# EAGLE design DNVT3 (EAGLE 9.6.2)
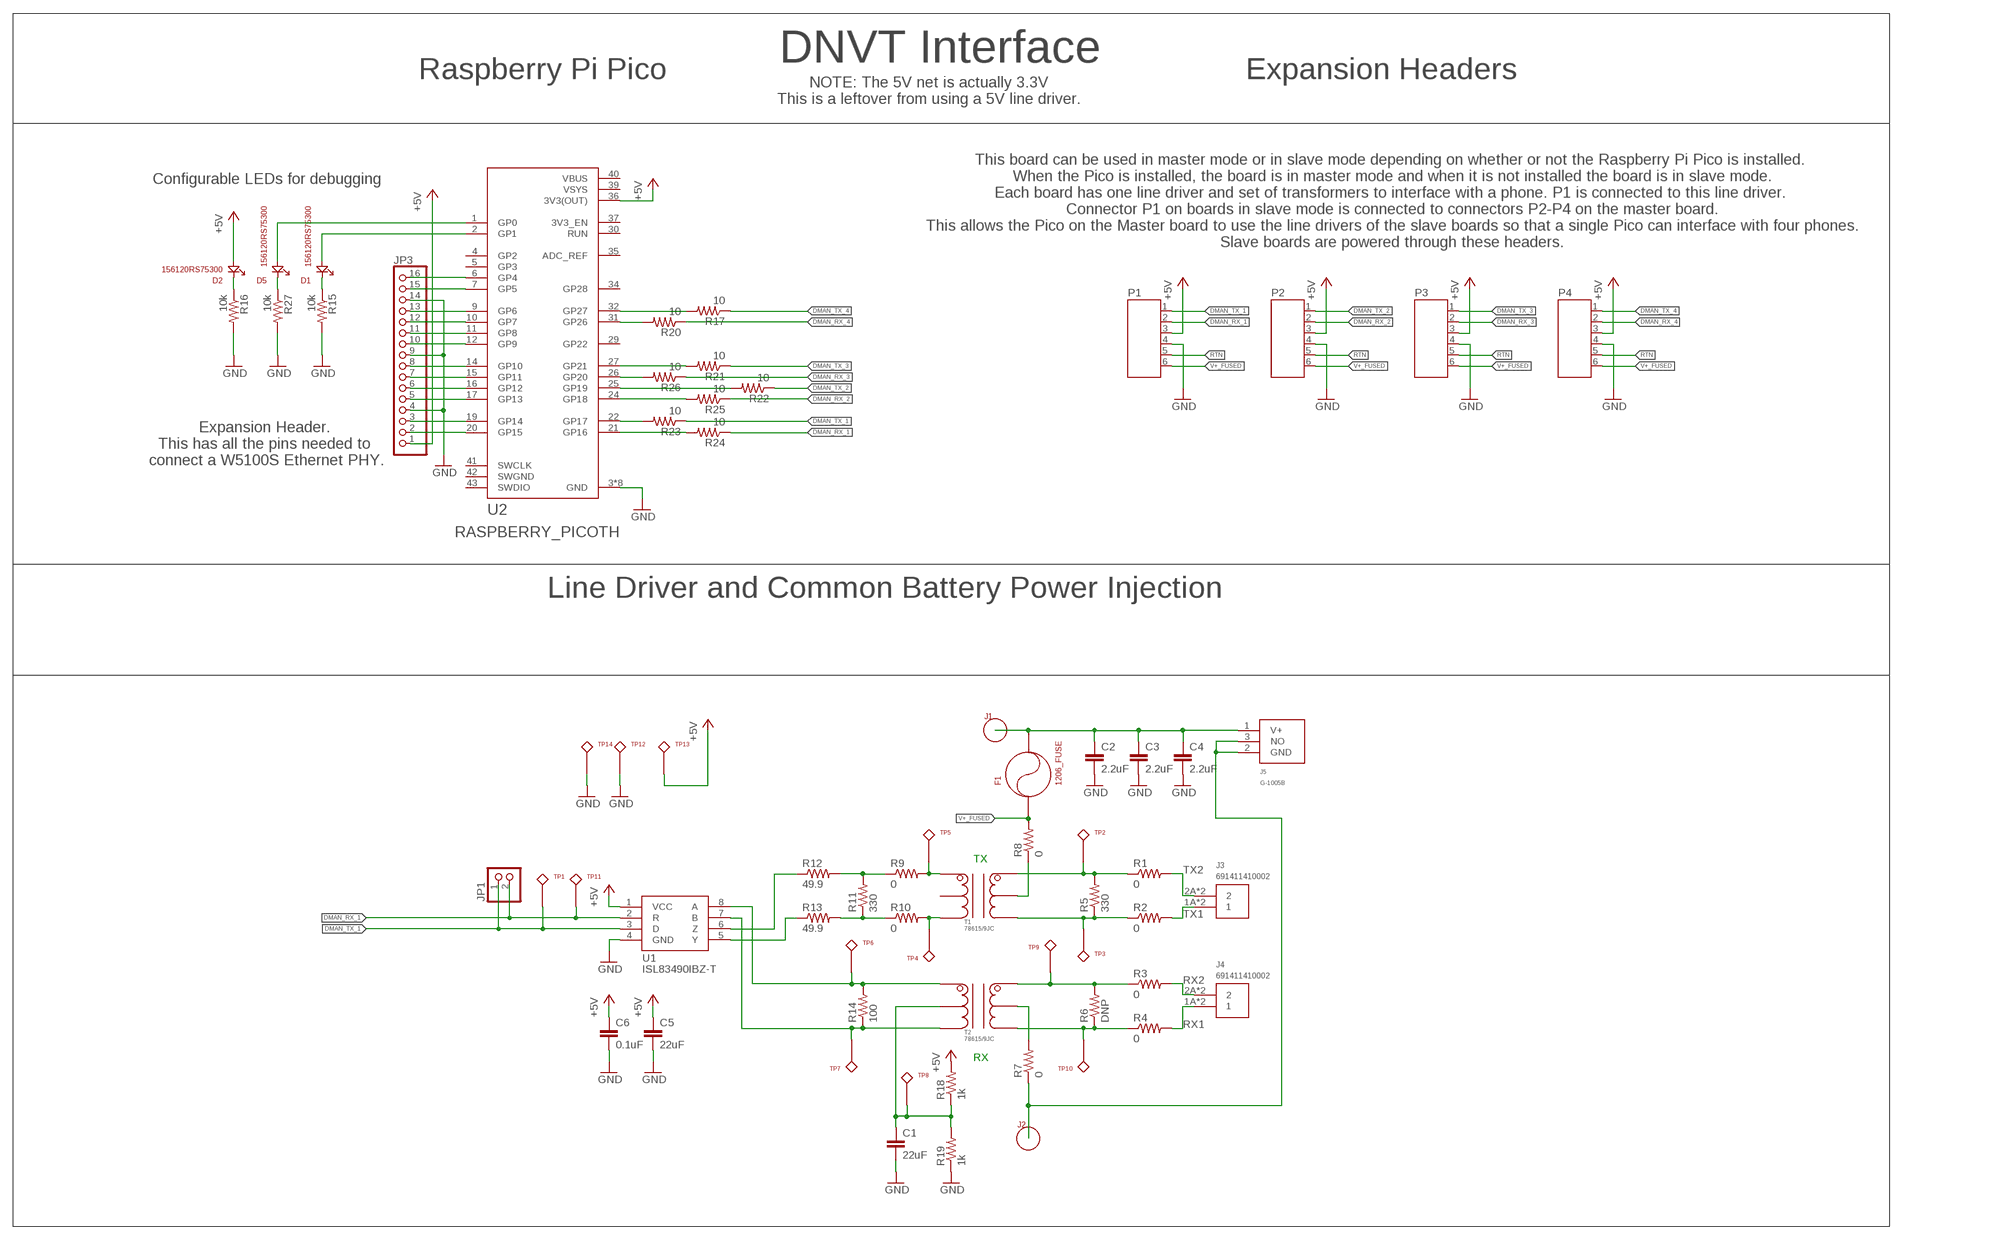
[diagram p0: schematic, sheet 1]

## Parts
C1  22uF  1210_CAPACITOR  [1210]
C2  2.2uF  1210_CAPACITOR  [1210]
C3  2.2uF  1210_CAPACITOR  [1210]
C4  2.2uF  1210_CAPACITOR  [1210]
C5  22uF  1210_CAPACITOR  [1210]
C6  0.1uF  0603_CAPACITOR  [0603]
D1  156120RS75300  [1206_REV]
D2  156120RS75300  [1206_REV]
D5  156120RS75300  [1206_REV]
F1  1206_FUSE  [1206]
J1  BANANA  [BANANA]
J2  BANANA  [BANANA]
J3  691411410002  [691411410002]
J4  691411410002  [691411410002]
J5  G-1005B  [G-1005B]
JP1  PINHD-1X2  [1X02]
JP3  PINHD-1X16  [1X16]
P1  JST-PH6  [JST-PH6]
P2  JST-PH6  [JST-PH6]
P3  JST-PH6  [JST-PH6]
P4  JST-PH6  [JST-PH6]
R1  0  R-US_R0805  [R0805]
R2  0  R-US_R0805  [R0805]
R3  0  R-US_R0805  [R0805]
R4  0  R-US_R0805  [R0805]
R5  330  R-US_R0805  [R0805]
R6  DNP  R-US_R0805  [R0805]
R7  0  R-US_R0805  [R0805]
R8  0  R-US_R0805  [R0805]
R9  0  R-US_R0805  [R0805]
R10  0  R-US_R0805  [R0805]
R11  330  R-US_R0805  [R0805]
R12  49.9  R-US_R0805  [R0805]
R13  49.9  R-US_R0805  [R0805]
R14  100  1206_RESISTOR  [1206]
R15  10k  0603_RESISTOR  [0603]
R16  10k  0603_RESISTOR  [0603]
R17  10  0603_RESISTOR  [0603]
R18  1k  0603_RESISTOR  [0603]
R19  1k  0603_RESISTOR  [0603]
R20  10  0603_RESISTOR  [0603]
R21  10  0603_RESISTOR  [0603]
R22  10  0603_RESISTOR  [0603]
R23  10  0603_RESISTOR  [0603]
R24  10  0603_RESISTOR  [0603]
R25  10  0603_RESISTOR  [0603]
R26  10  0603_RESISTOR  [0603]
R27  10k  0603_RESISTOR  [0603]
T1  78615/9JC  [786]
T2  78615/9JC  [786]
TP1  5001  [5001]
TP2  5002  [5001]
TP3  5002  [5001]
TP4  5002  [5001]
TP5  5002  [5001]
TP6  5002  [5001]
TP7  5002  [5001]
TP8  5002  [5001]
TP9  5002  [5001]
TP10  5002  [5001]
TP11  5001  [5001]
TP12  5001  [5001]
TP13  5001  [5001]
TP14  5001  [5001]
U1  ISL83490IBZ-T  [SOIC8]
U2  RASPBERRY_PICOTH  [PICO-PKG-TH]

## Nets
+5V: C5.1 C6.1 D2.A JP3.1 P1.3 P2.3 P3.3 P4.3 R18.2 TP13.P$1 U1.1(VCC) U2.36(3V3(OUT))
DMAN_RX_1: JP1.2 P1.2 R24.1 TP11.P$1 U1.2(R)
DMAN_RX_2: P2.2 R25.1
DMAN_RX_3: P3.2 R26.1
DMAN_RX_4: P4.2 R20.1
DMAN_TX_1: JP1.1 P1.1 R23.1 TP1.P$1 U1.3(D)
DMAN_TX_2: P2.1 R22.1
DMAN_TX_3: P3.1 R21.1
DMAN_TX_4: P4.1 R17.1
GND: C1.2 C2.2 C3.2 C4.2 C5.2 C6.2 JP3.4 JP3.9 JP3.14 P1.4 P2.4 P3.4 P4.4 R15.2 R16.2 R19.1 R27.2 TP12.P$1 TP14.P$1 U1.4(GND) U2.3(GND) U2.8(GND) U2.13(GND) U2.18(GND) U2.23(GND) U2.28(GND) U2.33(GND) U2.38(GND)
N$1: R1.1 R5.2 T1.6 TP2.P$1
N$2: R2.1 R5.1 T1.4 TP3.P$1
N$3: R3.1 R6.2 T2.6 TP9.P$1
N$4: R4.1 R6.1 T2.4 TP10.P$1
N$5: R7.2 T2.5
N$6: R8.1 T1.5
N$7: C1.1 R18.1 R19.2 T2.2 TP8.P$1
N$8: R14.1 T2.3 TP7.P$1 U1.7(B)
N$9: R14.2 T2.1 TP6.P$1 U1.8(A)
N$10: R9.2 T1.1 TP5.P$1
N$11: R10.2 T1.3 TP4.P$1
N$12: R9.1 R11.2 R12.2
N$13: R10.1 R11.1 R13.2
N$14: R12.1 U1.6(Z)
N$15: R13.1 U1.5(Y)
N$16: R24.2 U2.21(GP16)
N$17: R23.2 U2.22(GP17)
N$18: D1.K R15.1
N$19: C2.1 C3.1 C4.1 F1.2 J1.P$1 J5.1(V+)
N$20: D2.K R16.1
N$21: R25.2 U2.24(GP18)
N$22: R22.2 U2.25(GP19)
N$23: R21.2 U2.27(GP21)
N$24: R26.2 U2.26(GP20)
N$25: R17.2 U2.32(GP27)
N$26: R20.2 U2.31(GP26)
N$27: D5.K R27.1
N$28: JP3.16 U2.6(GP4)
N$29: D1.A U2.2(GP1)
N$30: D5.A U2.1(GP0)
N$31: JP3.15 U2.7(GP5)
N$32: JP3.13 U2.9(GP6)
N$33: JP3.12 U2.10(GP7)
N$34: JP3.11 U2.11(GP8)
N$35: JP3.10 U2.12(GP9)
N$36: JP3.8 U2.14(GP10)
N$37: JP3.7 U2.15(GP11)
N$38: JP3.6 U2.16(GP12)
N$39: JP3.5 U2.17(GP13)
N$40: JP3.3 U2.19(GP14)
N$41: JP3.2 U2.20(GP15)
RTN: J2.P$1 J5.2(GND) J5.3(NO) P1.5 P2.5 P3.5 P4.5 R7.1
RX1: J4.1A J4.1B R4.2
RX2: J4.2A J4.2B R3.2
TX1: J3.1A J3.1B R2.2
TX2: J3.2A J3.2B R1.2
V+_FUSED: F1.1 P1.6 P2.6 P3.6 P4.6 R8.2
Unconnected: T1.2 U2.4(GP2) U2.5(GP3) U2.29(GP22) U2.30(RUN) U2.34(GP28) U2.35(ADC_REF) U2.37(3V3_EN) U2.41(SWCLK) U2.43(SWDIO)

## Notes on the sheet
- DNVT Interface
- Raspberry Pi Pico | Expansion Headers
- NOTE: The 5V net is actually 3.3V
  This is a leftover from using a 5V line driver.
- Configurable LEDs for debugging
- This board can be used in master mode or in slave mode depending on whether or not the Raspberry Pi Pico is installed. 
  When the Pico is installed, the board is in master mode and when it is not installed the board is in slave mode.
  Each board has one line driver and set of transformers to interface with a phone. P1 is connected to this line driver. 
  Connector P1 on boards in slave mode is connected to connectors P2-P4 on the master board.
  This allows the Pico on the Master board to use the line drivers of the slave boards so that a single Pico can interface with four phones.
  Slave boards are powered through these headers.
- Expansion Header. 
  This has all the pins needed to 
  connect a W5100S Ethernet PHY.
- Line Driver and Common Battery Power Injection
- TX
- RX

## Power pins joined to a net without a drawn wire
SWGND: U2.42(SWGND)
VBUS: U2.40(VBUS)
VSYS: U2.39(VSYS)

## Library data of the parts
C1-C5 = ruark2:1210_CAPACITOR: NO VALUE
C6 = ruark2:0603_CAPACITOR: 0603 Capacitor -- WARNING: NO DEFINED VALUE OR PART NUMBER; VALUE: sel
D1 D2 D5 = ruark2:156120RS75300: Red 624nm LED Indication - Discrete 2V 1206 Reverse Mount (3216 Metric); PARTNO: 732-5031-1-ND
F1 = ruark2:1206_FUSE
J1 J2 = ruark2:BANANA: JACK NON-INSULATED .218" Banana; PARTNO: 36-575-4-ND
J3 J4 = ruark2:691411410002: 2 Position Wire to Board Terminal Block Horizontal with Board 0.300" (7.62mm) Through Hole; PARTNO: 732-11084-ND
J5 = ruark2:G-1005B: Power Barrel Connector Jack 2.50mm ID (0.098"), 5.50mm OD (0.217") Through Hole, Right Angle; PARTNO: 1939-G-1005B-ND
JP1 = pinhead:PINHD-1X2: PIN HEADER
JP3 = pinhead:PINHD-1X16: PIN HEADER
P1-P4 = jst-ph:JST-PH6
R1-R13 = rcl:R-US_: RESISTOR, American symbol; SPICEPREFIX: R
R14 = ruark2:1206_RESISTOR: NO DEFINED PN; VALUE: sel
R15-R27 = ruark2:0603_RESISTOR: 0603 Resistor -- WARNING: NO DEFINED PART NUMBER OR VALUE; VALUE: sel
T1 T2 = ruark2:78615/9JC: 10mH General Purpose Pulse Transformer 1CT:1CT Surface Mount 56Vus; PARTNO: 811-2423-ND
TP1 TP11-TP14 = ruark2:5001: Black PC Test Point, Miniature Phosphor Bronze, Silver Plating 0.040" (1.02mm) Hole Diameter Mounting Type; PARTNO: 36-5001-ND
TP2-TP10 = ruark2:5002: White PC Test Point, Miniature Phosphor Bronze, Silver Plating 0.040" (1.02mm) Hole Diameter Mounting Type; PARTNO: 36-5002-ND
U1 = ruark2:ISL83490IBZ-T: 1/1 Transceiver Full RS422, RS485 8-SOIC 3.3V; PARTNO: ISL83490IBZ-TCT-ND
U2 = RpiPico:RASPBERRY_PICO: Raspberry Pi Pico

## Board
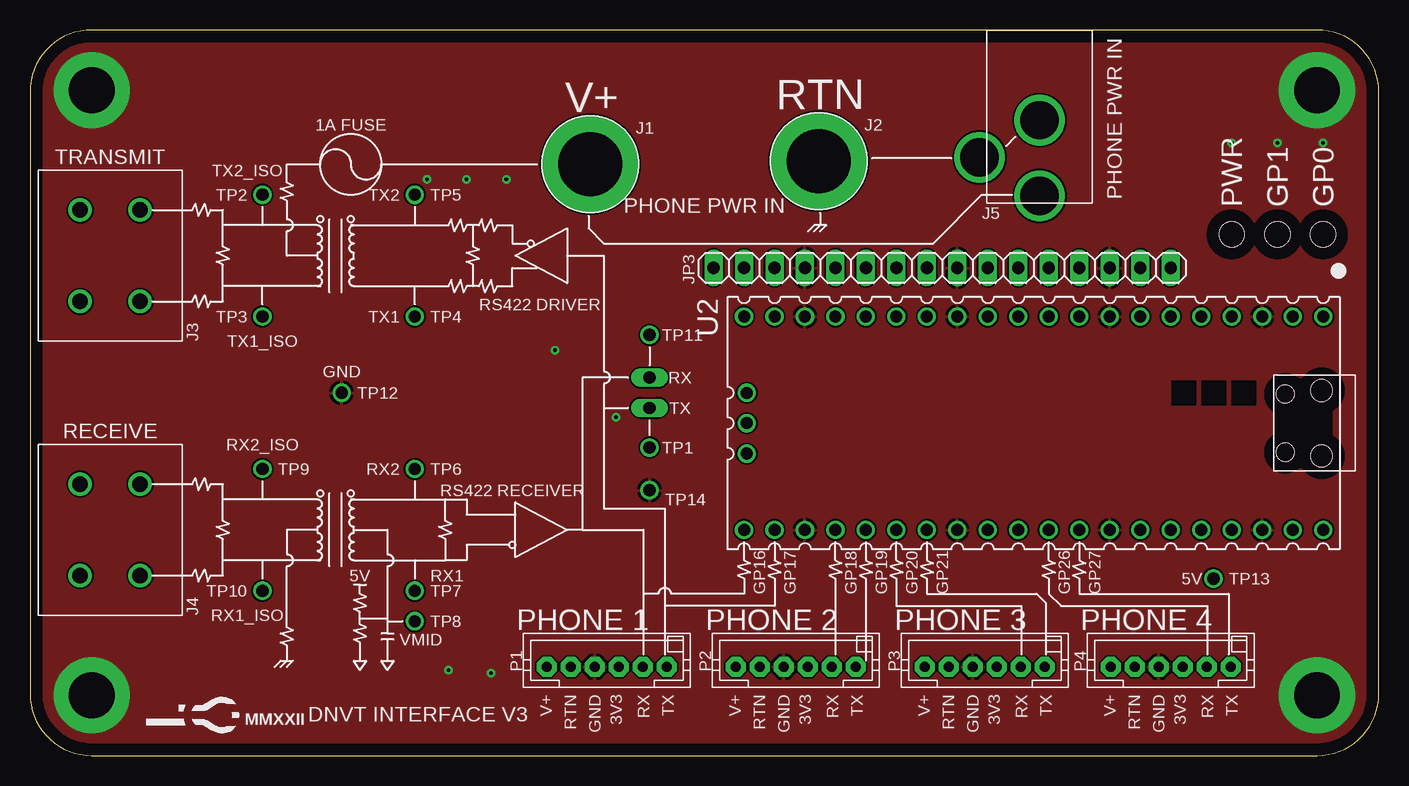
[diagram p1: board, top side]
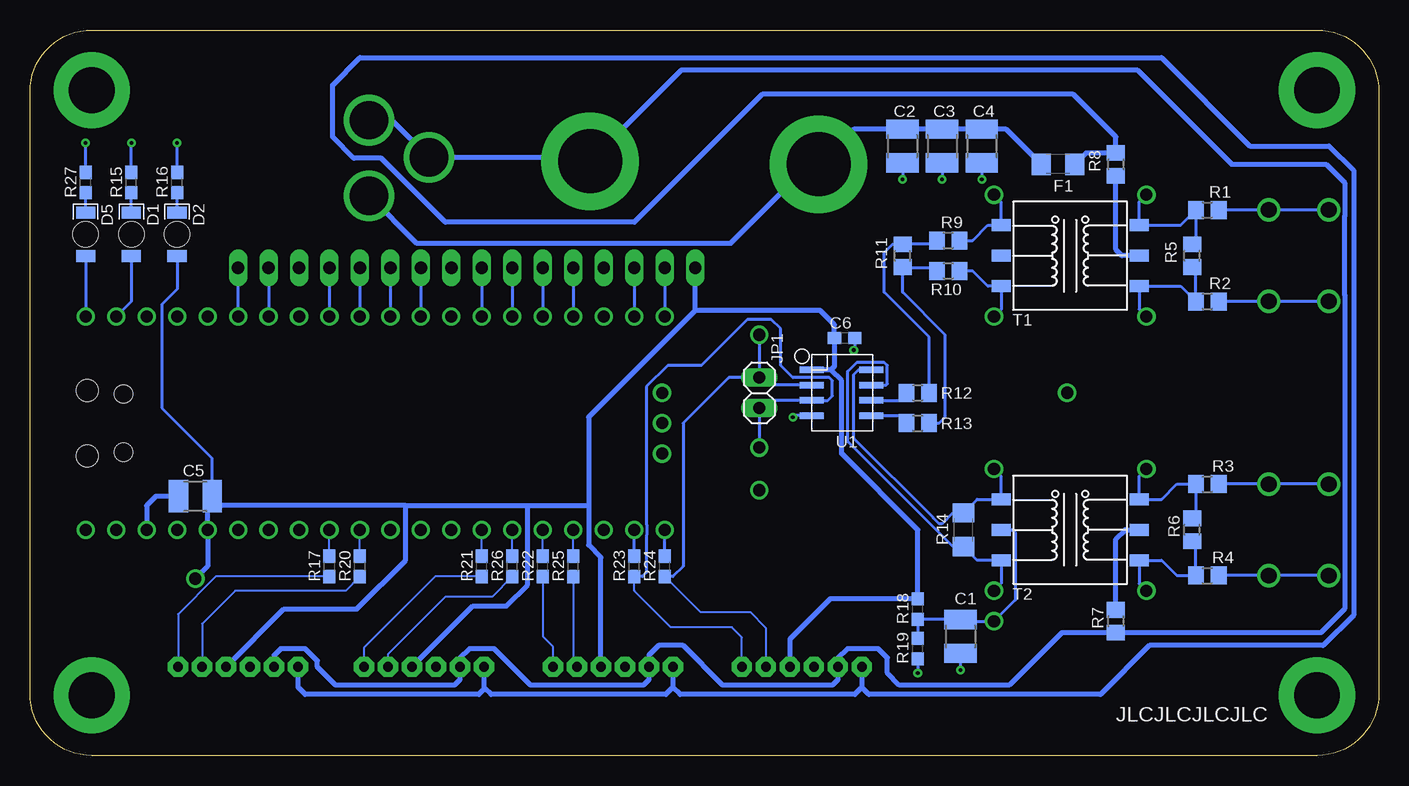
[diagram p2: board, bottom side, seen from below]

Size 112.4 x 60.5 mm. Coordinates in mm from the lower left corner, seen from the top.
Outline: 0,55.35 0,5.15 arc90 5.15,0 107.25,0 arc90 112.4,5.15 112.4,55.35 arc90 107.25,60.5 5.15,60.5 arc90 0,55.35
Copper layers (1*16): Top 0.035mm / dielectric 1.5mm / Bottom 0.035mm
Design rules "default *": minimum track width 6mil, minimum drill 12mil, track to track 6mil, track to pad 6mil, pad to pad 6mil, via to via 6mil, smd to smd 6mil, copper to edge 40mil, drill to drill 6mil, minimum pad ring 10mil, minimum via ring 8mil, stop-mask expansion 4mil, vias tented up to drill 0mil, thermal gap 10mil

### Footprints (pad centres in the part's own frame; a part is rotated, then mirrored left to right if it is on the bottom)
1210 = smd 1.6 x 2.7: 1 -1.4,0; 2 1.4,0
0603 = smd 1.1 x 1: 1 -0.85,0; 2 0.85,0
1206_REV = smd 1 x 1.6: A -1.8,0; K 1.8,0 | hole 2.1: 0,0
1206 = smd 1.6 x 1.8: 1 -1.4,0; 2 1.4,0
BANANA = drill 5.334 pad 8.128: P$1 0,0
691411410002 = drill 1.3: 1A -3.81,2.5; 1B -3.81,-2.5; 2A 3.81,2.5; 2B 3.81,-2.5
G-1005B = drill 3.2: 1 0,13.8; 2 0,7.5; 3 5,10.6
1X02 = drill 1.016 long: 1 -1.27,0; 2 1.27,0
1X16 = drill 1.016 long: 1 -19.05,0; 2 -16.51,0; 3 -13.97,0; 4 -11.43,0; 5 -8.89,0; 6 -6.35,0; 7 -3.81,0; 8 -1.27,0; 9 1.27,0; 10 3.81,0; 11 6.35,0; 12 8.89,0; 13 11.43,0; 14 13.97,0; 15 16.51,0; 16 19.05,0
JST-PH6 = drill 0.813 pad 1.676 octagon: 1 5,0; 2 3,0; 3 1,0; 4 -1,0; 5 -3,0; 6 -5,0
R0805 = smd 1.3 x 1.5: 1 -0.95,0; 2 0.95,0
786 = smd 1.6 x 1: 1 -5.75,2.54; 2 -5.75,0; 3 -5.75,-2.54; 4 5.75,-2.54; 5 5.75,0; 6 5.75,2.54
5001 = drill 1.016: P$1 0,0
SOIC8 = smd 1.981 x 0.533: 1 -2.477,1.905; 2 -2.477,0.635; 3 -2.477,-0.635; 4 -2.477,-1.905; 5 2.477,-1.905; 6 2.477,-0.635; 7 2.477,0.635; 8 2.477,1.905
PICO-PKG-TH = drill 1: 1 -8.89,24.13; 2 -8.89,21.59; 3 -8.89,19.05; 4 -8.89,16.51; 5 -8.89,13.97; 6 -8.89,11.43; 7 -8.89,8.89; 8 -8.89,6.35; 9 -8.89,3.81; 10 -8.89,1.27; 11 -8.89,-1.27; 12 -8.89,-3.81; 13 -8.89,-6.35; 14 -8.89,-8.89; 15 -8.89,-11.43; 16 -8.89,-13.97; 17 -8.89,-16.51; 18 -8.89,-19.05; 19 -8.89,-21.59; 20 -8.89,-24.13; 21 8.89,-24.13; 22 8.89,-21.59; 23 8.89,-19.05; 24 8.89,-16.51; 25 8.89,-13.97; 26 8.89,-11.43; 27 8.89,-8.89; 28 8.89,-6.35; 29 8.89,-3.81; 30 8.89,-1.27; 31 8.89,1.27; 32 8.89,3.81; 33 8.89,6.35; 34 8.89,8.89; 35 8.89,11.43; 36 8.89,13.97; 37 8.89,16.51; 38 8.89,19.05; 39 8.89,21.59; 40 8.89,24.13; 41 -2.54,-23.9; 42 0,-23.9; 43 2.54,-23.9 | hole 1.8: -2.725,24; 2.725,24 | hole 1.5: -2.425,20.97; 2.425,20.97

### Placement (x,y rotation side)
C1  34.86,9.93 270 bottom
C2  39.69,50.82 270 bottom
C3  36.39,50.82 270 bottom
C4  33.09,50.82 270 bottom
C5  98.62,21.61 180 bottom
C6  44.52,34.82 0 bottom
D1  103.95,43.46 90 bottom
D2  100.14,43.46 90 bottom
D5  107.76,43.46 90 bottom
F1  26.74,49.3 180 bottom
J1  46.68,49.3 0 top
J2  65.73,49.55 0 top
J3  6.67,41.68 90 top
J4  6.67,18.82 90 top
J5  84.14,60.48 180 top
JP1  51.63,30.25 90 bottom
JP3  76.01,40.66 0 top
P1  48.07,7.39 0 top
P2  63.82,7.39 0 top
P3  79.57,7.39 0 top
P4  95.06,7.39 0 top
R1  14.29,45.49 0 bottom
R2  14.29,37.87 0 bottom
R3  14.29,22.63 0 bottom
R4  14.29,15.01 0 bottom
R5  15.56,41.68 90 bottom
R6  15.56,18.82 90 bottom
R7  21.91,11.2 90 bottom
R8  21.91,49.3 90 bottom
R9  35.88,42.95 0 bottom
R10  35.88,40.41 0 bottom
R11  39.69,41.68 90 bottom
R12  38.42,30.25 0 bottom
R13  38.42,27.71 0 bottom
R14  34.61,18.82 90 bottom
R15  103.95,47.78 90 bottom
R16  100.14,47.78 90 bottom
R17  87.44,15.77 90 bottom
R18  38.42,12.22 90 bottom
R19  38.42,8.91 90 bottom
R20  84.9,15.77 90 bottom
R21  74.74,15.77 90 bottom
R22  69.66,15.77 90 bottom
R23  62.04,15.77 90 bottom
R24  59.5,15.77 90 bottom
R25  67.12,15.77 90 bottom
R26  72.2,15.77 90 bottom
R27  107.76,47.78 90 bottom
T1  25.72,41.68 0 bottom
T2  25.72,18.82 0 bottom
TP1  51.63,25.68 0 top
TP2  19.37,46.76 0 top
TP3  19.37,36.6 0 top
TP4  32.07,36.6 0 top
TP5  32.07,46.76 0 top
TP6  32.07,23.9 0 top
TP7  32.07,13.74 0 top
TP8  32.07,11.2 0 top
TP9  19.37,23.9 0 top
TP10  19.37,13.74 0 top
TP11  51.63,35.08 0 top
TP12  25.97,30.25 0 top
TP13  98.62,14.76 0 top
TP14  51.63,22.12 0 top
U1  44.77,30.25 0 bottom
U2  83.63,27.71 270 top

### Tracks (layer width: path | path; a pad name or v marks a point on that pad's centre or on a via)
+5V
  Bottom 0.254: 45.28,34.73 C6.1 | 96.59,21.74 97.1,21.64 C5.1 | D2.A 100.14,38.89 101.41,37.62 101.41,28.98 97.24,24.8 97.24,21.5
  Bottom 0.406: P3.3 75.49,12.47 72.71,12.47 70.93,14.25 70.93,20.85 | P2.3 64.82,16.52 65.85,17.55 65.85,20.85 | P4.3 91.24,12.22 85.16,12.22 81.09,16.28 81.09,20.85 | 81.09,20.85 70.93,20.85 | 70.93,20.85 65.85,20.85 | P1.3 49.07,9.69 45.7,13.07 R18.2 38.42,18.82 44.77,25.17 44.77,31.27 45.66,32.16 | C5.1 96.46,20.85 81.09,20.85 | 97.1,21.64 97.24,21.5 97.6,21.14 U2.36 97.6,15.77 TP13.P$1 | 45.66,32.16 U1.1 | 45.66,32.16 45.37,32.45 C6.1 45.37,35.93 46.55,37.11 56.96,37.11 | 65.85,20.85 65.85,28.22 56.96,37.11 | 56.96,37.11 JP3.1
DMAN_RX_1
  Bottom 0.152: R24.1 56.54,11.96 52.39,11.96 51.07,10.64 P1.2
  Bottom 0.254: U1.2 50.99,30.89 JP1.2 | TP11.P$1 JP1.2 | JP1.2 54.17,31.52 57.98,27.71 57.98,15.77 58.83,14.92 R24.1
DMAN_RX_2
  Bottom 0.152: R25.1 67.12,7.69 P2.2
DMAN_RX_3
  Bottom 0.152: P3.2 82.57,8.45 77.79,13.23 73.89,13.23 R26.1
DMAN_RX_4
  Bottom 0.152: P4.2 98.06,10.99 95.32,13.74 86.08,13.74 R20.1
DMAN_TX_1
  Bottom 0.152: P1.1 53.07,9.85 53.91,10.69 58.99,10.69 62.04,13.74 R23.1
  Bottom 0.254: 51.63,28.73 JP1.1 50.99,29.61 U1.3 45.91,29.61 45.53,30 45.53,31.27 45.79,31.52 48.83,31.52 49.85,32.54 49.85,35.58 50.61,36.35 52.64,36.35 56.45,32.54 59.25,32.54 61.03,30.76 61.03,19.27 61.01,19.25 61.01,18.39 61.03,18.38 61.03,15.26 61.37,14.92 R23.1 | 51.63,28.73 TP1.P$1 | 51.88,28.98 51.63,28.73
DMAN_TX_2
  Bottom 0.152: R22.1 69.66,9.93 68.82,9.09 P2.1
DMAN_TX_3
  Bottom 0.152: P3.1 84.57,8.99 78.64,14.92 R21.1
DMAN_TX_4
  Bottom 0.152: R17.1 96.93,14.92 100.06,11.79 P4.1
GND  (via drill 0.3, 3.81 pad 6.35)
  Bottom 0.254: C6.2 43.67,33.89 v43.75,33.81 | U1.4 48.71,28.34 v48.83,28.22 | C2.2 v39.69,48.03 | C3.2 v36.39,48.03 | C4.2 v33.09,48.03 | R19.1 v38.42,6.88 | C1.2 v34.86,7.14 | R16.2 v100.14,51.08 | R15.2 v103.95,51.08 | R27.2 v107.76,51.08
  Bottom 0.406: C5.2 101.92,21.61 102.68,20.85 U2.38
  other vias: 5.15,55.48 5.15,5.02 107.25,55.48 107.25,5.02
  pour Top: 0.2,54.25 0.2,55.1 arc-90 5.35,60.25 107.05,60.25 arc-90 112.2,55.1 112.2,5.4 arc-90 107.05,0.25 5.35,0.25 arc-90 0.2,5.4
N$1
  Bottom 0.254: R5.2 15.24,42.95 R1.1 16.51,44.22 T1.6 19.97,46.16 TP2.P$1
N$2
  Bottom 0.254: R5.1 15.24,40.41 R2.1 16.51,39.14 T1.4 19.97,37.2 TP3.P$1
N$3
  Bottom 0.254: TP9.P$1 19.97,23.3 T2.6 18.1,21.36 16.83,22.63 R3.1 15.24,20.09 R6.2
N$4
  Bottom 0.254: TP10.P$1 19.97,14.34 T2.4 18.1,16.28 16.83,15.01 R4.1 15.24,17.55 R6.1
N$5
  Bottom 0.254: 20.64,18.82 T2.5
  Bottom 0.406: R7.2 21.91,18.06 21.15,18.82 T2.5
N$6
  Bottom 0.406: T1.5 21.4,41.68 21.91,42.19 R8.1
N$7
  Bottom 0.254: R19.2 R18.1 34.9,11.37 C1.1 34.73,11.2 TP8.P$1 30.29,12.98 30.29,18.57 30.55,18.82 T2.2
N$8
  Bottom 0.254: TP7.P$1 31.47,14.34 T2.3 33.47,16.28 R14.1 35.5,17.42 44.26,26.19 44.26,32.03 43.5,32.79 41.21,32.79 40.96,32.54 40.96,31.01 41.09,30.89 U1.7
N$9
  Bottom 0.254: TP6.P$1 31.47,23.3 T2.1 33.47,21.36 R14.2 35.5,20.22 36.39,19.33 36.64,19.33 37.08,19.77 37.15,19.84 43.75,26.44 43.75,31.77 43.37,32.16 U1.8
N$10
  Bottom 0.254: R9.2 33.85,42.95 32.58,44.22 T1.1 31.47,46.16 TP5.P$1
N$11
  Bottom 0.254: R10.2 33.85,40.41 32.58,39.14 T1.3 31.47,37.2 TP4.P$1
N$12
  Bottom 0.254: R12.2 37.47,34.89 41.21,38.63 41.21,41.93 40.52,42.63 R11.2 37.15,42.63 R9.1
N$13
  Bottom 0.254: R13.2 36.64,27.71 36.13,28.22 36.13,35.08 39.69,38.63 39.69,40.66 | 39.69,40.66 R11.1 | R10.1 37.08,40.66 39.69,40.66
N$14
  Bottom 0.254: U1.6 40.01,29.61 R12.1
N$15
  Bottom 0.254: U1.5 40.01,28.34 R13.1
N$16
  Bottom 0.254: R24.2 U2.21
N$17
  Bottom 0.254: R23.2 U2.22
N$18
  Bottom 0.254: D1.K R15.1
N$19
  Bottom 0.406: J5.1 80.16,42.7 54.04,42.7 47.44,49.3 J1.P$1 43.75,52.22 C2.1 37.02,52.22 | 37.02,52.22 37.15,52.09 | 37.02,52.22 C3.1 C4.1 31.06,52.22 F1.2
N$20
  Bottom 0.254: D2.K R16.1
N$21
  Bottom 0.152: R25.2 U2.24
N$22
  Bottom 0.152: R22.2 U2.25
N$23
  Bottom 0.152: R21.2 U2.27
N$24
  Bottom 0.152: R26.2 U2.26
N$25
  Bottom 0.152: R17.2 U2.32
N$26
  Bottom 0.152: R20.2 U2.31
N$27
  Bottom 0.254: D5.K R27.1
N$28
  Bottom 0.254: U2.6 JP3.16
N$29
  Bottom 0.254: D1.A 103.95,37.87 U2.2
N$30
  Bottom 0.254: D5.A U2.1
N$31
  Bottom 0.254: JP3.15 U2.7
N$32
  Bottom 0.254: JP3.13 U2.9
N$33
  Bottom 0.254: JP3.12 U2.10
N$34
  Bottom 0.254: JP3.11 U2.11
N$35
  Bottom 0.254: JP3.10 U2.12
N$36
  Bottom 0.254: JP3.8 U2.14
N$37
  Bottom 0.254: JP3.7 U2.15
N$38
  Bottom 0.254: JP3.6 U2.16
N$39
  Bottom 0.254: JP3.5 U2.17
N$40
  Bottom 0.254: JP3.3 U2.19
N$41
  Bottom 0.254: JP3.2 U2.20
RTN
  Bottom 0.254: R7.1 21.66,10.25 20.71,10.25 20.13,10.18
  Bottom 0.406: J5.2 82.24,52.98 J5.3 66.05,49.88 J2.P$1 58.11,57.17 20.13,57.17 12.26,49.3 4.38,49.3 2.84,47.75 2.84,44.94 2.86,44.92 2.86,38.44 2.84,38.42 2.84,12.24 4.83,10.25 21.66,10.25 | R7.1 26.42,10.25 30.8,5.87 39.94,5.87 40.96,6.88 40.96,8.15 41.72,8.91 44.26,8.91 45.07,8.1 P1.5 45.07,6.33 45.53,5.87 54.68,5.87 57.98,9.17 60.01,9.17 60.82,8.36 P2.5 60.82,6.33 61.28,5.87 70.68,5.87 73.73,8.91 75.76,8.91 76.57,8.1 P3.5 76.57,6.33 77.03,5.87 86.93,5.87 88.46,7.39 88.46,7.9 89.47,8.91 91.51,8.91 92.06,8.36 P4.5
RX1
  Bottom 0.254: J4.1A J4.1B R4.2
RX2
  Bottom 0.254: J4.2A J4.2B R3.2
TX1
  Bottom 0.254: J3.1A J3.1B R2.2
TX2
  Bottom 0.254: J3.2A J3.2B R1.2
V+_FUSED
  Bottom 0.406: F1.1 24.39,50.25 R8.2 21.91,51.59 25.47,55.14 51.37,55.14 62.04,44.47 77.79,44.47 83.12,49.81 85.41,49.81 87.19,51.59 87.19,55.9 84.9,58.19 18.1,58.19 10.73,50.82 4.13,50.82 2.1,48.79 2.1,11.71 4.64,9.17 19.12,9.17 23.18,5.1 42.48,5.1 43.07,5.69 | P1.6 43.07,5.69 | 43.07,5.69 43.66,5.1 58.23,5.1 58.82,5.69 | P2.6 58.82,5.69 | 58.82,5.69 59.41,5.1 73.98,5.1 74.49,5.61 | 74.49,5.61 75,5.1 89.47,5.1 90.06,5.69 P4.6 | P3.6 74.57,5.69 74.49,5.61

### Text on the board
tPlace: RTN | V+ | PHONE PWR IN | 1A FUSE | TRANSMIT | TX2_ISO | TX2 | PHONE PWR IN | PWR | GP1 | GP0 | RS422 DRIVER | TX1 | TX1_ISO | GND | RX | TX | RECEIVE | RX2_ISO | RX2 | RS422 RECEIVER | RX1 | GP16 | GP17 | GP18 | GP19 | GP20 | GP21 | GP26 | GP27 | 5V | 5V | RX1_ISO | PHONE 1 | PHONE 2 | PHONE 3 | PHONE 4 | VMID | V+ | RTN | GND | 3V3 | RX | TX | V+ | RTN | GND | 3V3 | RX | TX | V+ | RTN | GND | 3V3 | RX | TX | V+ | RTN | GND | 3V3 | RX | TX | DNVT INTERFACE V3 | MMXXII
bPlace: JLCJLCJLCJLC
tStop: 042